# EAGLE schematic RCMETER (EAGLE 9.2.0)
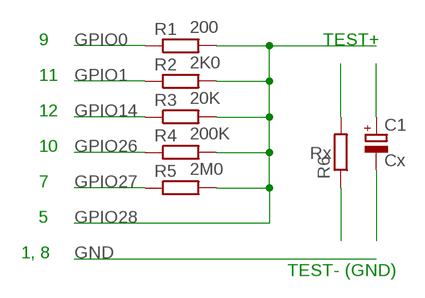
[diagram p0: schematic, sheet 1]

## Parts
C1  Cx  CPOL-EUB45181B  [B45181B]
R1  200  R-EU_0204/7  [0204/7]
R2  2K0  R-EU_0204/7  [0204/7]
R3  20K  R-EU_0204/7  [0204/7]
R4  200K  R-EU_0204/7  [0204/7]
R5  2M0  R-EU_0204/7  [0204/7]
R6  Rx  R-EU_0204/7  [0204/7]

## Nets
GPIO0: R1.1
GPIO1: R2.1
GPIO14: R3.1
GPIO26: R4.1
GPIO27: R5.1
GPIO28: R1.2 R2.2 R3.2 R4.2 R5.2
N$1: R6.2
N$2: R6.1
N$3: C1.+
N$4: C1.-

## Notes on the sheet
- 9 | TEST+
- 11
- 12
- 10
- 7
- 5
- 1, 8
- TEST- (GND)

## Library data of the parts
C1 = rcl:CPOL-EU: POLARIZED CAPACITOR, European symbol; SPICEPREFIX: C
R1-R6 = rcl:R-EU_: RESISTOR, European symbol; SPICEPREFIX: R